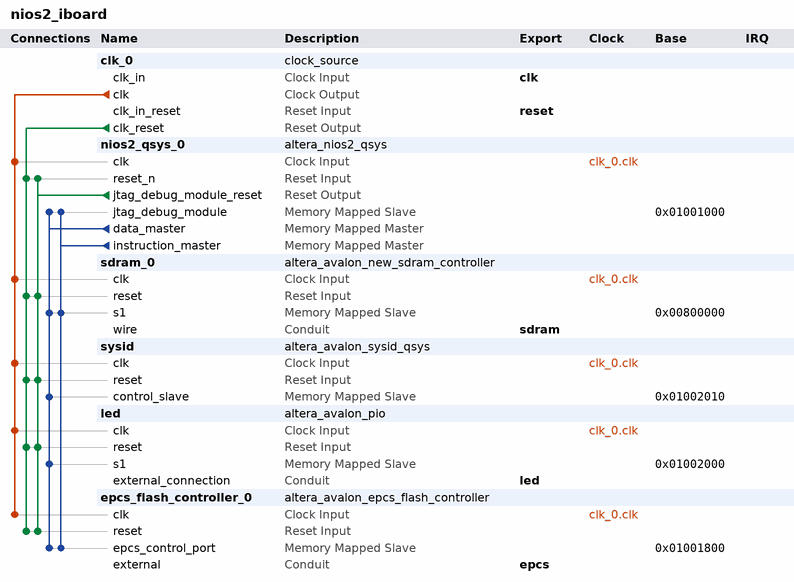
[diagram p0: system contents]
# Platform Designer (Qsys) system nios2_iboard
# Parameters at their usual value, and those the tool derives, are not listed.
package require -exact qsys 11.1
create_system nios2_iboard
set_project_property DEVICE_FAMILY CYCLONEIVE

add_instance clk_0 clock_source 11.1
set_instance_parameter_value clk_0 clockFrequency 100000000

add_instance nios2_qsys_0 altera_nios2_qsys 11.1
set_instance_parameter_value nios2_qsys_0 resetSlave epcs_flash_controller_0.epcs_control_port
set_instance_parameter_value nios2_qsys_0 exceptionSlave sdram_0.s1
set_instance_parameter_value nios2_qsys_0 breakSlave nios2_qsys_0.jtag_debug_module
set_instance_parameter_value nios2_qsys_0 impl Fast
set_instance_parameter_value nios2_qsys_0 icache_size 4096

add_instance sdram_0 altera_avalon_new_sdram_controller 11.1
set_instance_parameter_value sdram_0 TAC 5.5
set_instance_parameter_value sdram_0 TRCD 20.0
set_instance_parameter_value sdram_0 TRP 20.0
set_instance_parameter_value sdram_0 casLatency 2
set_instance_parameter_value sdram_0 columnWidth 8
set_instance_parameter_value sdram_0 dataWidth 16
set_instance_parameter_value sdram_0 generateSimulationModel false
set_instance_parameter_value sdram_0 model custom
set_instance_parameter_value sdram_0 numberOfBanks 4
set_instance_parameter_value sdram_0 numberOfChipSelects 1
set_instance_parameter_value sdram_0 powerUpDelay 100.0
set_instance_parameter_value sdram_0 refreshPeriod 15.625
set_instance_parameter_value sdram_0 rowWidth 12

add_instance sysid altera_avalon_sysid_qsys 11.1
set_instance_parameter_value sysid id 7

add_instance led altera_avalon_pio 11.1
set_instance_parameter_value led direction Output
set_instance_parameter_value led width 1

add_instance epcs_flash_controller_0 altera_avalon_epcs_flash_controller 11.1

# connections
add_connection clk_0.clk epcs_flash_controller_0.clk clock
add_connection clk_0.clk led.clk clock
add_connection clk_0.clk nios2_qsys_0.clk clock
add_connection clk_0.clk sdram_0.clk clock
add_connection clk_0.clk sysid.clk clock
add_connection clk_0.clk_reset epcs_flash_controller_0.reset reset
add_connection clk_0.clk_reset led.reset reset
add_connection clk_0.clk_reset nios2_qsys_0.reset_n reset
add_connection clk_0.clk_reset sdram_0.reset reset
add_connection clk_0.clk_reset sysid.reset reset
add_connection nios2_qsys_0.jtag_debug_module_reset epcs_flash_controller_0.reset reset
add_connection nios2_qsys_0.jtag_debug_module_reset led.reset reset
add_connection nios2_qsys_0.jtag_debug_module_reset nios2_qsys_0.reset_n reset
add_connection nios2_qsys_0.jtag_debug_module_reset sdram_0.reset reset
add_connection nios2_qsys_0.jtag_debug_module_reset sysid.reset reset
add_connection nios2_qsys_0.data_master epcs_flash_controller_0.epcs_control_port avalon
set_connection_parameter_value nios2_qsys_0.data_master/epcs_flash_controller_0.epcs_control_port baseAddress 0x01001800
add_connection nios2_qsys_0.data_master led.s1 avalon
set_connection_parameter_value nios2_qsys_0.data_master/led.s1 baseAddress 0x01002000
add_connection nios2_qsys_0.data_master nios2_qsys_0.jtag_debug_module avalon
set_connection_parameter_value nios2_qsys_0.data_master/nios2_qsys_0.jtag_debug_module baseAddress 0x01001000
add_connection nios2_qsys_0.data_master sdram_0.s1 avalon
set_connection_parameter_value nios2_qsys_0.data_master/sdram_0.s1 baseAddress 0x00800000
add_connection nios2_qsys_0.data_master sysid.control_slave avalon
set_connection_parameter_value nios2_qsys_0.data_master/sysid.control_slave baseAddress 0x01002010
add_connection nios2_qsys_0.instruction_master epcs_flash_controller_0.epcs_control_port avalon
set_connection_parameter_value nios2_qsys_0.instruction_master/epcs_flash_controller_0.epcs_control_port baseAddress 0x01001800
add_connection nios2_qsys_0.instruction_master nios2_qsys_0.jtag_debug_module avalon
set_connection_parameter_value nios2_qsys_0.instruction_master/nios2_qsys_0.jtag_debug_module baseAddress 0x01001000
add_connection nios2_qsys_0.instruction_master sdram_0.s1 avalon
set_connection_parameter_value nios2_qsys_0.instruction_master/sdram_0.s1 baseAddress 0x00800000

# exported interfaces
add_interface clk clock sink
set_interface_property clk EXPORT_OF clk_0.clk_in
add_interface reset reset sink
set_interface_property reset EXPORT_OF clk_0.clk_in_reset
add_interface led conduit end
set_interface_property led EXPORT_OF led.external_connection
add_interface sdram conduit end
set_interface_property sdram EXPORT_OF sdram_0.wire
add_interface epcs conduit end
set_interface_property epcs EXPORT_OF epcs_flash_controller_0.external

save_system nios2_iboard.qsys
